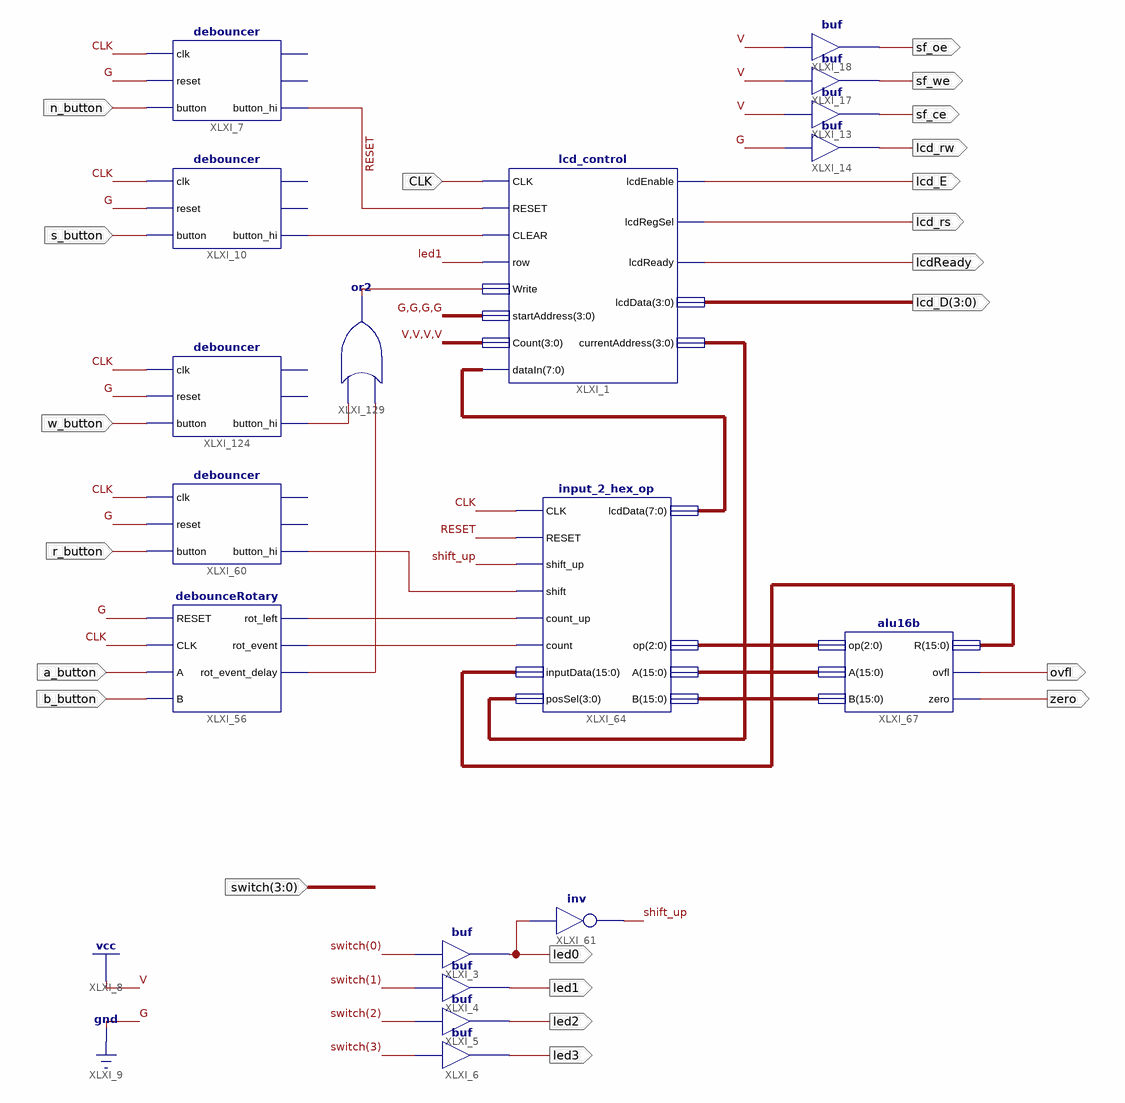
[diagram p0: schematic sheet 1]
// Xilinx ISE schematic aluIO.sch (spartan3e) as structural Verilog: 18 symbols, 22 ports
module aluIO (
  input  CLK,
  input  s_button,
  input  [3:0] switch,
  input  n_button,
  input  a_button,
  input  b_button,
  input  r_button,
  input  w_button,
  output lcdReady,
  output lcd_rs,
  output lcd_E,
  output sf_ce,
  output lcd_rw,
  output sf_we,
  output sf_oe,
  output led1,
  output led0,
  output led2,
  output led3,
  output [3:0] lcd_D,
  output ovfl,
  output zero
);

  wire RESET, shift_up, XLXN_54, XLXN_116, XLXN_135, XLXN_136, XLXN_144, XLXN_368, XLXN_369;
  wire [2:0] XLXN_145;
  wire [3:0] XLXN_124;
  wire [7:0] XLXN_118;
  wire [15:0] XLXN_146, XLXN_147, XLXN_150;

  buf XLXI_13 (sf_ce, 1'b1);
  buf XLXI_14 (lcd_rw, 1'b0);
  buf XLXI_17 (sf_we, 1'b1);
  buf XLXI_18 (sf_oe, 1'b1);
  lcd_control XLXI_1 (
    .CLK(CLK), .RESET(RESET), .CLEAR(XLXN_54), .Write(XLXN_369), .startAddress(4'b0000), .Count(4'b1111),
    .dataIn(XLXN_118), .lcdEnable(lcd_E), .lcdRegSel(lcd_rs), .lcdReady(lcdReady), .currentAddress(XLXN_124),
    .lcdData(lcd_D), .row(led1));
  buf XLXI_3 (led0, switch[0]);
  buf XLXI_4 (led1, switch[1]);
  buf XLXI_5 (led2, switch[2]);
  buf XLXI_6 (led3, switch[3]);
  not XLXI_61 (shift_up, led0);
  input_2_hex_op XLXI_64 (
    .count_up(XLXN_135), .CLK(CLK), .RESET(RESET), .shift(XLXN_144), .shift_up(shift_up), .count(XLXN_136),
    .posSel(XLXN_124), .inputData(XLXN_150), .lcdData(XLXN_118), .op(XLXN_145), .A(XLXN_146), .B(XLXN_147));
  alu16b XLXI_67 (.op(XLXN_145), .A(XLXN_146), .B(XLXN_147), .R(XLXN_150), .ovfl(ovfl), .zero(zero));
  or XLXI_129 (XLXN_369, XLXN_116, XLXN_368);
  debouncer XLXI_124 (.clk(CLK), .reset(1'b0), .button(w_button), .button_hi(XLXN_368));  // open: debutton, button_lo
  debouncer XLXI_7 (.clk(CLK), .reset(1'b0), .button(n_button), .button_hi(RESET));  // open: debutton, button_lo
  debouncer XLXI_10 (.clk(CLK), .reset(1'b0), .button(s_button), .button_hi(XLXN_54));  // open: debutton, button_lo
  debounceRotary XLXI_56 (
    .A(a_button), .B(b_button), .CLK(CLK), .RESET(1'b0), .rot_event(XLXN_136), .rot_event_delay(XLXN_116),
    .rot_left(XLXN_135));
  debouncer XLXI_60 (.clk(CLK), .reset(1'b0), .button(r_button), .button_hi(XLXN_144));  // open: debutton, button_lo
endmodule
